# EAGLE schematic Transistor controlled bell switch with connectors (EAGLE 9.6.2)
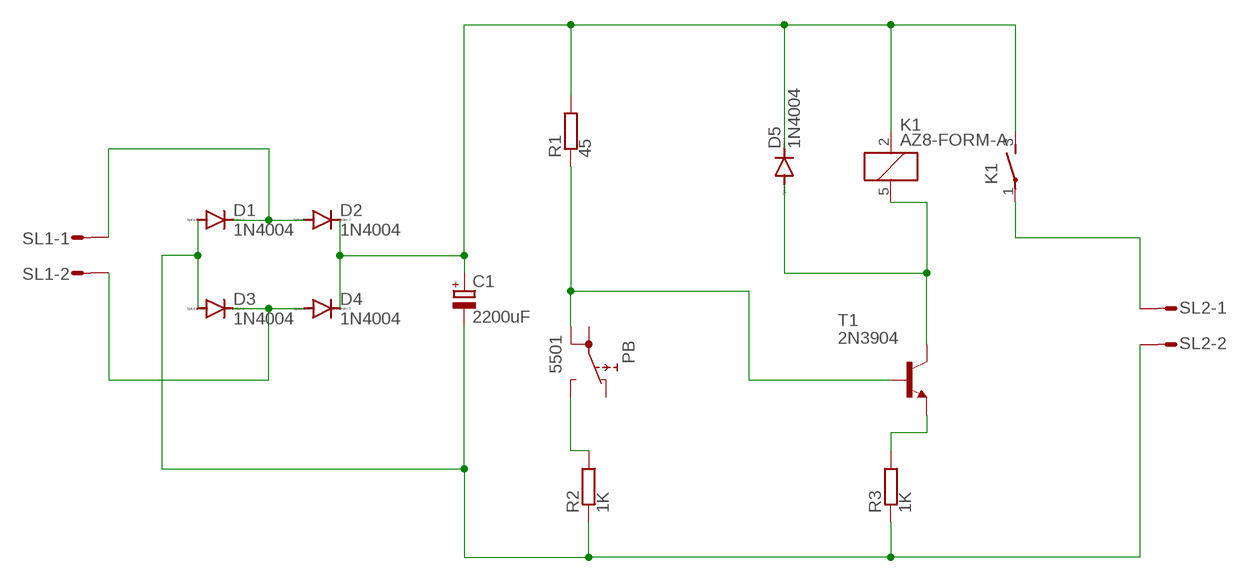
[diagram p0: schematic, sheet 1]

## Parts
C1  2200uF  CPOL-EU085CS-1AR  [085CS_1AR]
D1  1N4004  [DO41-10]
D2  1N4004  [DO41-10]
D3  1N4004  [DO41-10]
D4  1N4004  [DO41-10]
D5  1N4004  [DO41-10]
K1  AZ8-FORM-A  [AZ8]
PB  5501  [5501]
R1  45  PMD  [PMD]
R2  1K  PMD  [PMD]
R3  1K  PMD  [PMD]
SL1  M02S  [02P]
SL2  M02S  [02P]
T1  2N3904  [TO92]

## Nets
N$1: D1.C D2.A SL1.1
N$2: PB.NO R2.1
N$3: D3.C D4.A SL1.2
N$4: PB.1B R1.2 T1.2(B)
N$5: C1.- D1.A D3.A R2.2 R3.2 SL2.2
N$6: C1.+ D2.C D4.C D5.C K1.2 K1.3(-1:S) R1.1
N$7: R3.1 T1.3(E)
N$11: D5.A K1.5 T1.1(C)
N$12: K1.1(-1:P) SL2.1
Unconnected: PB.1A PB.NC

## Library data of the parts
C1 = rcl:CPOL-EU: POLARIZED CAPACITOR, European symbol; SPICEPREFIX: C
D1-D5 = diode:1N4004: DIODE general purpose rectifier, 1 A
K1 = relay:AZ8-FORM-A: MINIATURE PC BOARD RELAY Form A Source: www.azettler.com .. AZ8-1ch-12DSE.PDF; OC_FARNELL: unknown; OC_NEWARK: unknown
PB = switch:55?: PUSHBUTTON SERIES 5500 SWITCHES Source: www.e-switch.com .. 5500.pdf
R1-R3 = resistor-shunt:PMD: SMD SHUNT RESISTOR; OC_FARNELL: unknown; OC_NEWARK: unknown
SL1 SL2 = con-amp-quick:M02S: AMP QUICK CONNECTOR; OC_FARNELL: unknown; OC_NEWARK: unknown
T1 = transistor:2N3904: NPN TRANSISTOR